# EAGLE design RCP2P (EAGLE 5.09)
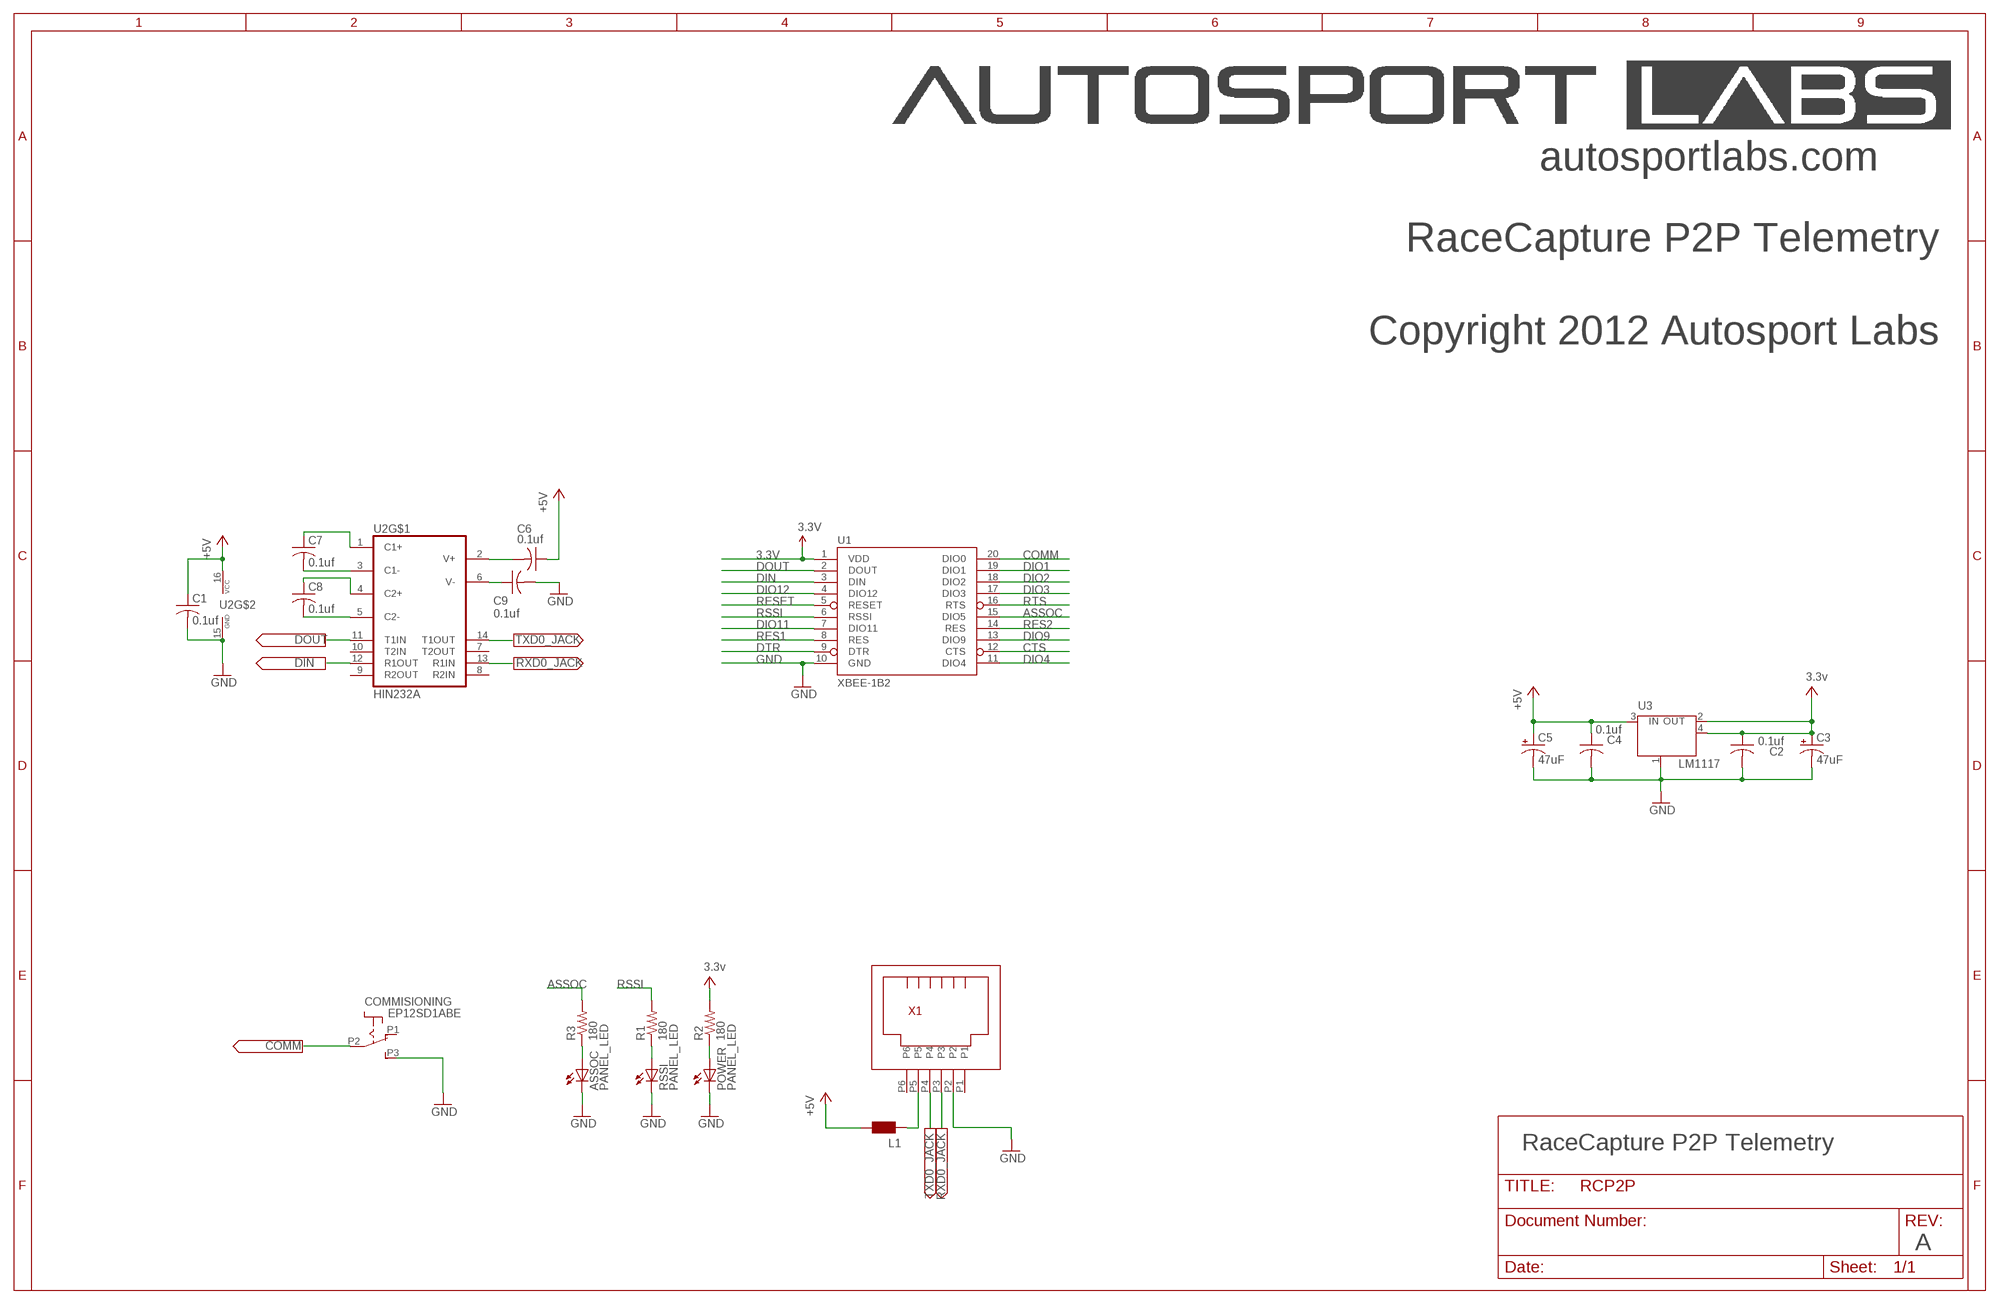
[diagram p0: schematic, sheet 1]

## Parts
ASSOC  PANEL_LED  [RIGHTANGLE_CML_5323F5]
C1  0.1uf  C-USC0603  [C0603]
C2  0.1uf  C-USC0603  [C0603]
C3  47uF  CPOL-USSMCD  [SMC_D]
C4  0.1uf  C-USC0603  [C0603]
C5  47uF  CPOL-USSMCD  [SMC_D]
C6  0.1uf  C-USC0603  [C0603]
C7  0.1uf  C-USC0603  [C0603]
C8  0.1uf  C-USC0603  [C0603]
C9  0.1uf  C-USC0603  [C0603]
COMMISIONING  EP12SD1ABE  [EP12SD1ABE]
L1  WE-CBF_1812  [1812]
POWER  PANEL_LED  [RIGHTANGLE_CML_5323F5]
R1  180  RESISTOR0603  [0603]
R2  180  RESISTOR0603  [0603]
R3  180  RESISTOR0603  [0603]
RSSI  PANEL_LED  [RIGHTANGLE_CML_5323F5]
U1  XBEE-1B2  [XBEE-SILK]
U2  HIN232A  [SOIC-16]
U3  LM1117  [SOT223]
X1  FCI_88400_066LF_RJ12_4POS  [RJ12_RIGHT_ANGLE_PCB]

## Nets
3.3V [vcc]: C2.1 C3.+ U1.1(VDD) U3.2(OUT) U3.4(OUT) ; supply symbol labelled 3.3v
+5V: C1.1 C4.1 C5.+ C6.1 L1.2 U2.16(VCC) U3.3(IN)
ASSOC: R3.2 U1.15(DIO5)
COMM: COMMISIONING.P2(P) U1.20(DIO0)
CTS: U1.12(CTS)
DIN: U1.3(DIN) U2.12(R1OUT)
DIO1: U1.19(DIO1)
DIO2: U1.18(DIO2)
DIO3: U1.17(DIO3)
DIO4: U1.11(DIO4)
DIO9: U1.13(DIO9)
DIO11: U1.7(DIO11)
DIO12: U1.4(DIO12)
DOUT: U1.2(DOUT) U2.11(T1IN)
DTR: U1.9(DTR)
GND: ASSOC.C C1.2 C2.2 C3.- C4.2 C5.- C9.2 COMMISIONING.P3(S) POWER.C RSSI.C U1.10(GND) U2.15(GND) U3.1(GND/ADJ) X1.P2
N$1: L1.1 X1.P5
N$2: R1.1 RSSI.A
N$3: ASSOC.A R3.1
N$16: C7.1 U2.1(C1+)
N$17: C7.2 U2.3(C1-)
N$18: C8.1 U2.4(C2+)
N$19: C8.2 U2.5(C2-)
N$20: C6.2 U2.2(V+)
N$21: C9.1 U2.6(V-)
N$38: POWER.A R2.1
RES1: U1.8(RES)
RES2: U1.14(RES)
RESET: U1.5(RESET)
RSSI: R1.2 U1.6(RSSI)
RTS: U1.16(RTS)
RXD0_JACK: U2.13(R1IN) X1.P3
TXD0_JACK: U2.14(T1OUT) X1.P4
V+: R2.2 ; supply symbol labelled 3.3v
Unconnected: COMMISIONING.P1(O) U2.7(T2OUT) U2.8(R2IN) U2.9(R2OUT) U2.10(T2IN) X1.P1 X1.P6

## Notes on the sheet
- autosportlabs.com
- RaceCapture P2P Telemetry
- Copyright 2012 Autosport Labs
- RaceCapture P2P Telemetry
- A

## Library data of the parts
ASSOC POWER RSSI = LEDs:PANEL_LED
C1 C2 C4 C6-C9 = rcl:C-US: CAPACITOR, American symbol
C3 C5 = rcl:CPOL-US: POLARIZED CAPACITOR, American symbol
COMMISIONING = misc_switch:EP12SD1ABE
L1 = wuerth-elektronik:WE-CBF: SMD EMI Suppression Ferrite Beads - excellent anti-EMI properties - low DCR - impedances till 3000 ohms - rated current up to 6 A
R1-R3 = SparkFun:RESISTOR: Resistor Basic schematic elements and footprints for 0603, 1206, and PTH 1/10th watt (small) resistors.
U1 = SparkFun:XBEE-1
U2 = max232:HIN232A
U3 = lm1117:LM1117
X1 = FCI_RJ12:FCI_88400_066LF_RJ12_4POS

## Net classes
1 vcc: width 0.305 mm

## Board
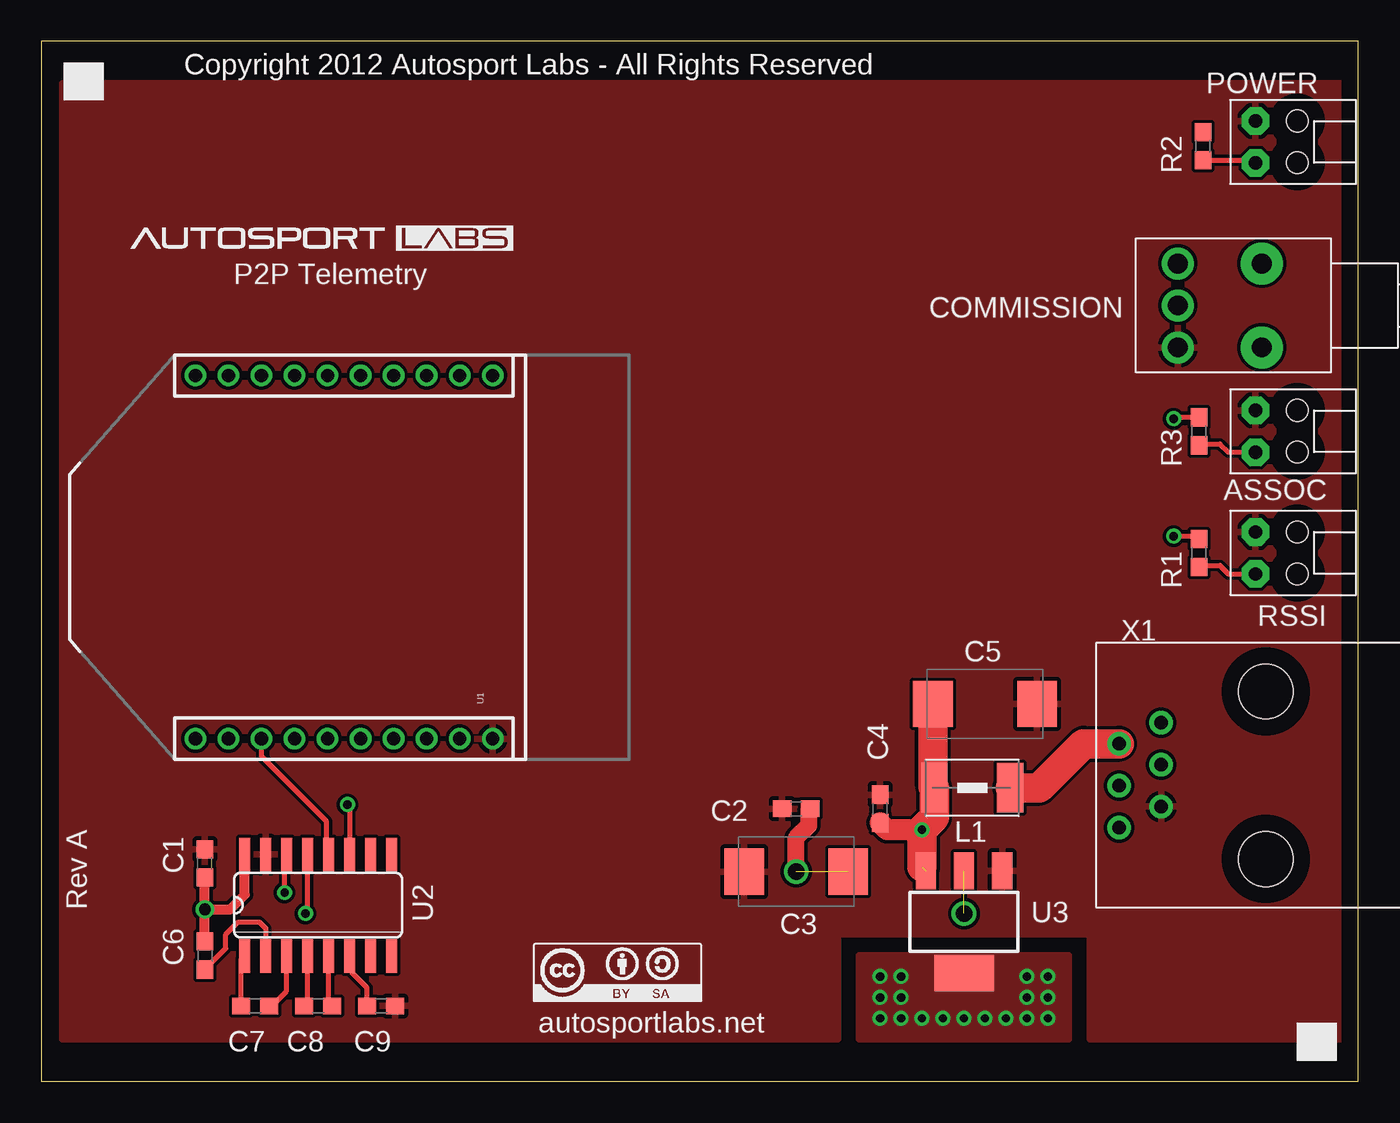
[diagram p1: board, top side]
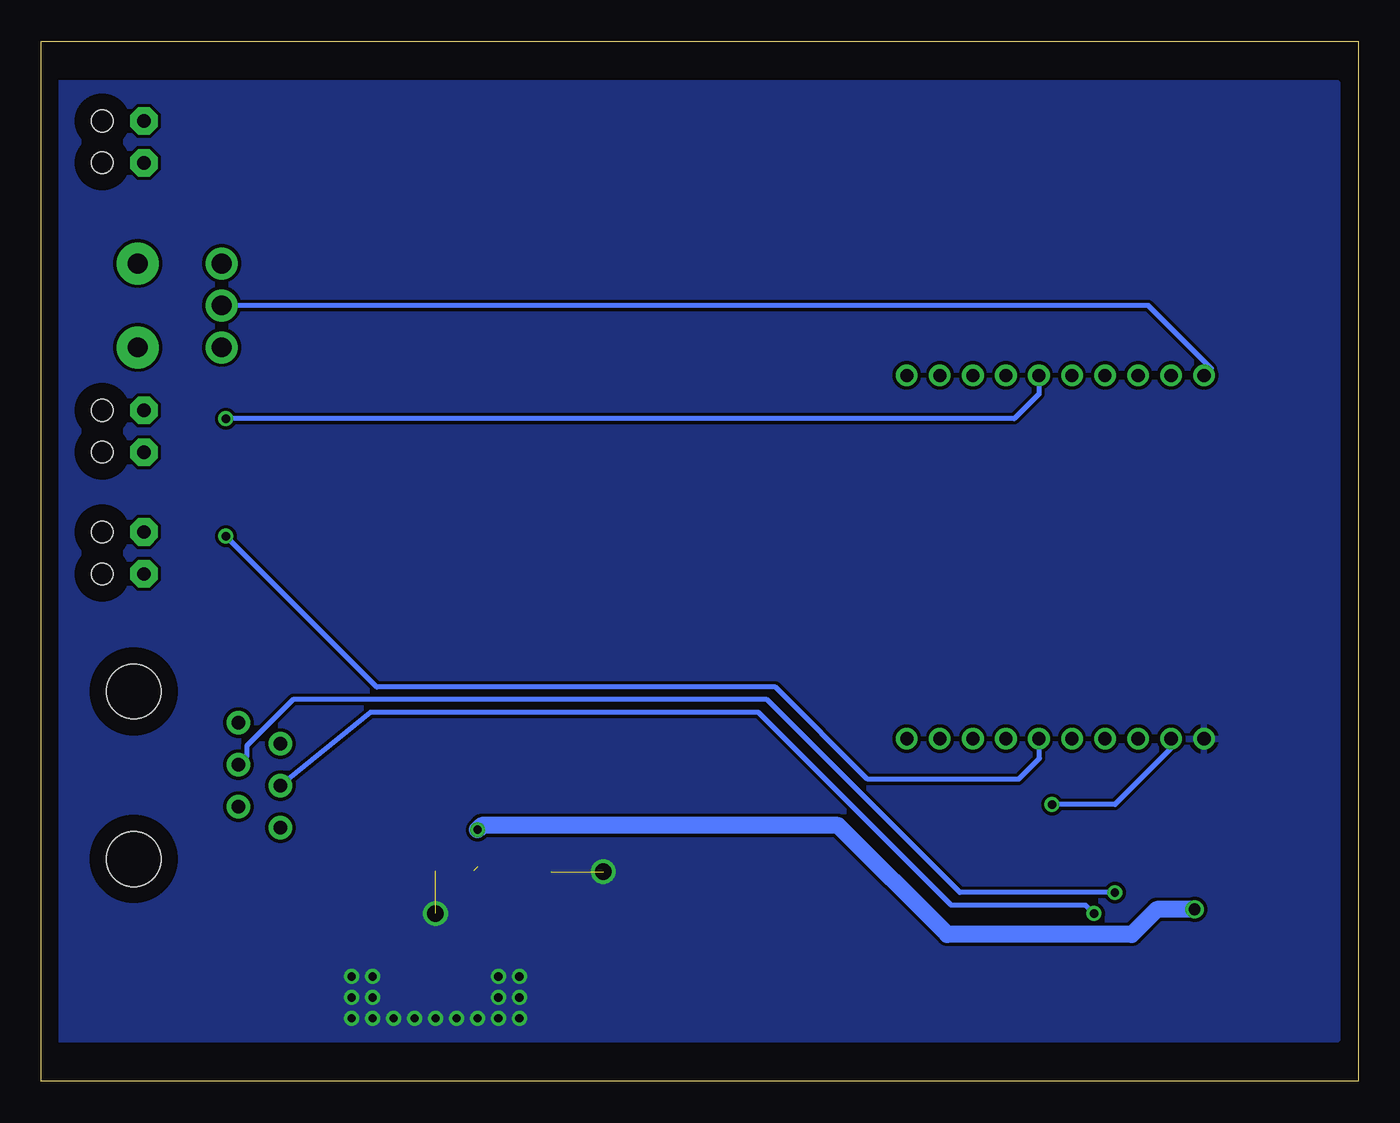
[diagram p2: board, bottom side, seen from below]

Size 79.76 x 62.99 mm. Coordinates in mm from the lower left corner, seen from the top.
Outline: 0,0 79.76,0 79.76,62.99 0,62.99 0,0
Copper layers (1*16): Top 0.035mm / dielectric 1.5mm / Bottom 0.035mm
Design rules "default *": minimum track width 8mil, minimum drill 16mil, track to track 8mil, track to pad 8mil, pad to pad 8mil, via to via 8mil, smd to smd 8mil, copper to edge 40mil, drill to drill 8mil, minimum pad ring 10mil, minimum via ring 8mil, stop-mask expansion 4mil, vias tented up to drill 0mil, thermal gap 10mil

### Footprints (pad centres in the part's own frame; a part is rotated, then mirrored left to right if it is on the bottom)
RIGHTANGLE_CML_5323F5 = drill 0.8 pad 1.676 octagon: A -1.27,1.651; C 1.27,1.651 | hole 1.295: 1.27,-0.889; -1.27,-0.889
C0603 = smd 1.1 x 1: 1 -0.85,0; 2 0.85,0
SMC_D = smd 2.4 x 2.8: + -3.15,0; - 3.15,0
EP12SD1ABE = drill 1.194 pad 2.54 round: BRACKET1 -2.54,-5.08; BRACKET2 2.54,-5.08 | drill 1.194 pad 1.93 round: P1 2.54,0; P2 0,0; P3 -2.54,0
1812 = smd 1.6 x 3: 1 -2.3,0; 2 2.3,0
0603 = smd 1.1 x 1: 1 -0.85,0; 2 0.85,0
XBEE-SILK = drill 0.8 round: 1 -11,20; 2 -11,18; 3 -11,16; 4 -11,14; 5 -11,12; 6 -11,10; 7 -11,8; 8 -11,6; 9 -11,4; 10 -11,2; 11 11,2; 12 11,4; 13 11,6; 14 11,8; 15 11,10; 16 11,12; 17 11,14; 18 11,16; 19 11,18; 20 11,20
SOIC-16 = smd 0.66 x 2.032: 1 -4.445,-3.073; 2 -3.175,-3.073; 3 -1.905,-3.073; 4 -0.635,-3.073; 5 0.635,-3.073; 6 1.905,-3.073; 7 3.175,-3.073; 8 4.445,-3.073; 9 4.445,3.073; 10 3.175,3.073; 11 1.905,3.073; 12 0.635,3.073; 13 -0.635,3.073; 14 -1.905,3.073; 15 -3.175,3.073; 16 -4.445,3.073
SOT223 = smd 1.219 x 2.235: 1 -2.311,-3.099; 2 0,-3.099; 3 2.311,-3.099 | smd 3.6 x 2.2: 4 0,3.099
RJ12_RIGHT_ANGLE_PCB = drill 0.8 pad 1.422 round: P1 -3.175,8.89; P2 -1.905,6.35; P3 -0.635,8.89; P4 0.635,6.35; P5 1.905,8.89; P6 3.175,6.35 | hole 3.302: -5.08,0; 5.08,0

### Placement (x,y rotation side)
ASSOC  75.18,39.37 90 top
C1  9.91,13.21 90 top
C2  45.72,16.51 180 top
C3  45.72,12.7 180 top
C4  50.8,16.51 90 top
C5  57.15,22.86 0 top
C6  9.91,7.62 270 top
C7  12.95,4.57 0 top
C8  16.76,4.57 0 top
C9  20.57,4.57 0 top
COMMISIONING  68.83,46.99 90 top
L1  56.39,17.78 180 top
POWER  75.18,56.9 90 top
R1  70.1,32 90 top
R2  70.36,56.64 90 top
R3  70.1,39.37 90 top
RSSI  75.18,32 90 top
U1  29.34,31.75 90 top
U2  16.76,10.67 0 top
U3  55.88,9.65 180 top
X1  74.17,18.54 90 top

### Tracks (layer width: path | path; a pad name or v marks a point on that pad's centre or on a via)
3.3V  (via drill 0.5, 1)  (2 unrouted)
  Top 1.016: C2.1 46.48,16.42 46.48,15.49 45.72,14.73 v45.72,12.7
  other vias: 55.88,10.16 50.8,6.35 50.8,3.81 52.07,3.81 50.8,5.08 52.07,5.08 53.34,3.81 54.61,3.81 55.88,3.81 57.15,3.81 58.42,3.81 59.69,3.81 59.69,5.08 59.69,6.35 60.96,6.35 60.96,5.08 60.96,3.81 52.07,6.35
  pour Bottom: 1.27,60.45 78.74,60.45 78.74,2.54 1.27,2.54
  pour Top (no thermals): 49.53,2.54 62.23,2.54 62.23,7.62 49.53,7.62
+5V  (via drill 0.5, 0.7)  (1 unrouted)
  Top 0.61: U2.16 12.32,11.3 11.43,10.41 v9.91,10.41 | v9.91,10.41 C1.1 | C6.1 v9.91,10.41
  Top 1.27: v53.34,15.24 51.22,15.24 C4.1
  Top 1.778: C5.+ 54,17.87 L1.2 54.09,15.99 v53.34,15.24 53.34,12.98
  Bottom 1.016: v9.91,10.41 12.19,10.41 13.72,8.89 24.89,8.89 31.5,15.49 53.09,15.49 v53.34,15.24
ASSOC  (via drill 0.5)
  Top 0.305: R3.2 68.67,40.22 v68.58,40.13
  Bottom 0.305: v68.58,40.13 20.83,40.13 19.34,41.62 U1.15
COMM
  Bottom 0.305: COMMISIONING.P2 12.7,46.99 8.89,43.18 9.32,42.75 U1.20
DIN
  Top 0.305: 17.53,13.87 U2.12 17.27,13.87 17.27,15.75 13.34,19.68 U1.3
DOUT  (via drill 0.5)
  Top 0.305: v18.54,16.76 18.67,16.64 U2.11
  Bottom 0.305: v18.54,16.76 14.73,16.76 11.34,20.16 U1.2
GND
  pour Top: 1.27,60.45 78.74,60.45 78.74,2.54 63.5,2.54 63.5,8.89 48.26,8.89 48.26,2.54 1.27,2.54
N$1
  Top 1.778: X1.P5 63.12,20.45 60.45,17.78 L1.1
N$2
  Top 0.305: R1.1 70.19,31.24 71.37,31.24 71.88,30.73 RSSI.A
N$3
  Top 0.305: ASSOC.A 71.88,38.1 71.37,38.61 70.19,38.61 R3.1
N$16
  Top 0.305: C7.1 12.1,7.38 U2.1
N$17
  Top 0.305: C7.2 13.97,4.57 14.86,5.46 U2.3
N$18
  Top 0.305: C8.1 16.13,4.79 U2.4
N$19
  Top 0.305: C8.2 17.4,4.79 U2.5
N$20
  Top 0.305: U2.2 13.59,9.27 13.21,9.65 11.94,9.65 11.18,8.89 11.18,8.04 C6.2
N$21
  Top 0.305: C9.1 19.72,5.68 18.8,6.6 18.8,7.47 U2.6
N$38
  Top 0.305: POWER.A 73.37,55.79 R2.1
RSSI  (via drill 0.5)
  Top 0.305: R1.2 70.06,33.02 v68.58,33.02
  Bottom 0.305: v68.58,33.02 59.44,23.88 35.31,23.88 29.72,18.29 20.57,18.29 19.3,19.56 19.3,20.72 U1.6
RXD0_JACK  (via drill 0.5)
  Top 0.305: v16,10.16 16.13,10.29 U2.13
  Bottom 0.305: X1.P3 59.82,22.35 36.32,22.35 24.64,10.67 16.51,10.67 v16,10.16
TXD0_JACK  (via drill 0.5)
  Top 0.305: v14.73,11.43 14.73,13.61 U2.14
  Bottom 0.305: v14.73,11.43 24.13,11.43 35.81,23.11 64.52,23.11 67.31,20.32 67.31,19.68 X1.P4

### Text on the board
tPlace: Copyright 2012 Autosport Labs - All Rights Reserved | P2P Telemetry | COMMISSION | Rev A | autosportlabs.net